# Altium schematic sheet MP_MB_2014-12-17_B.SchDoc
size A2
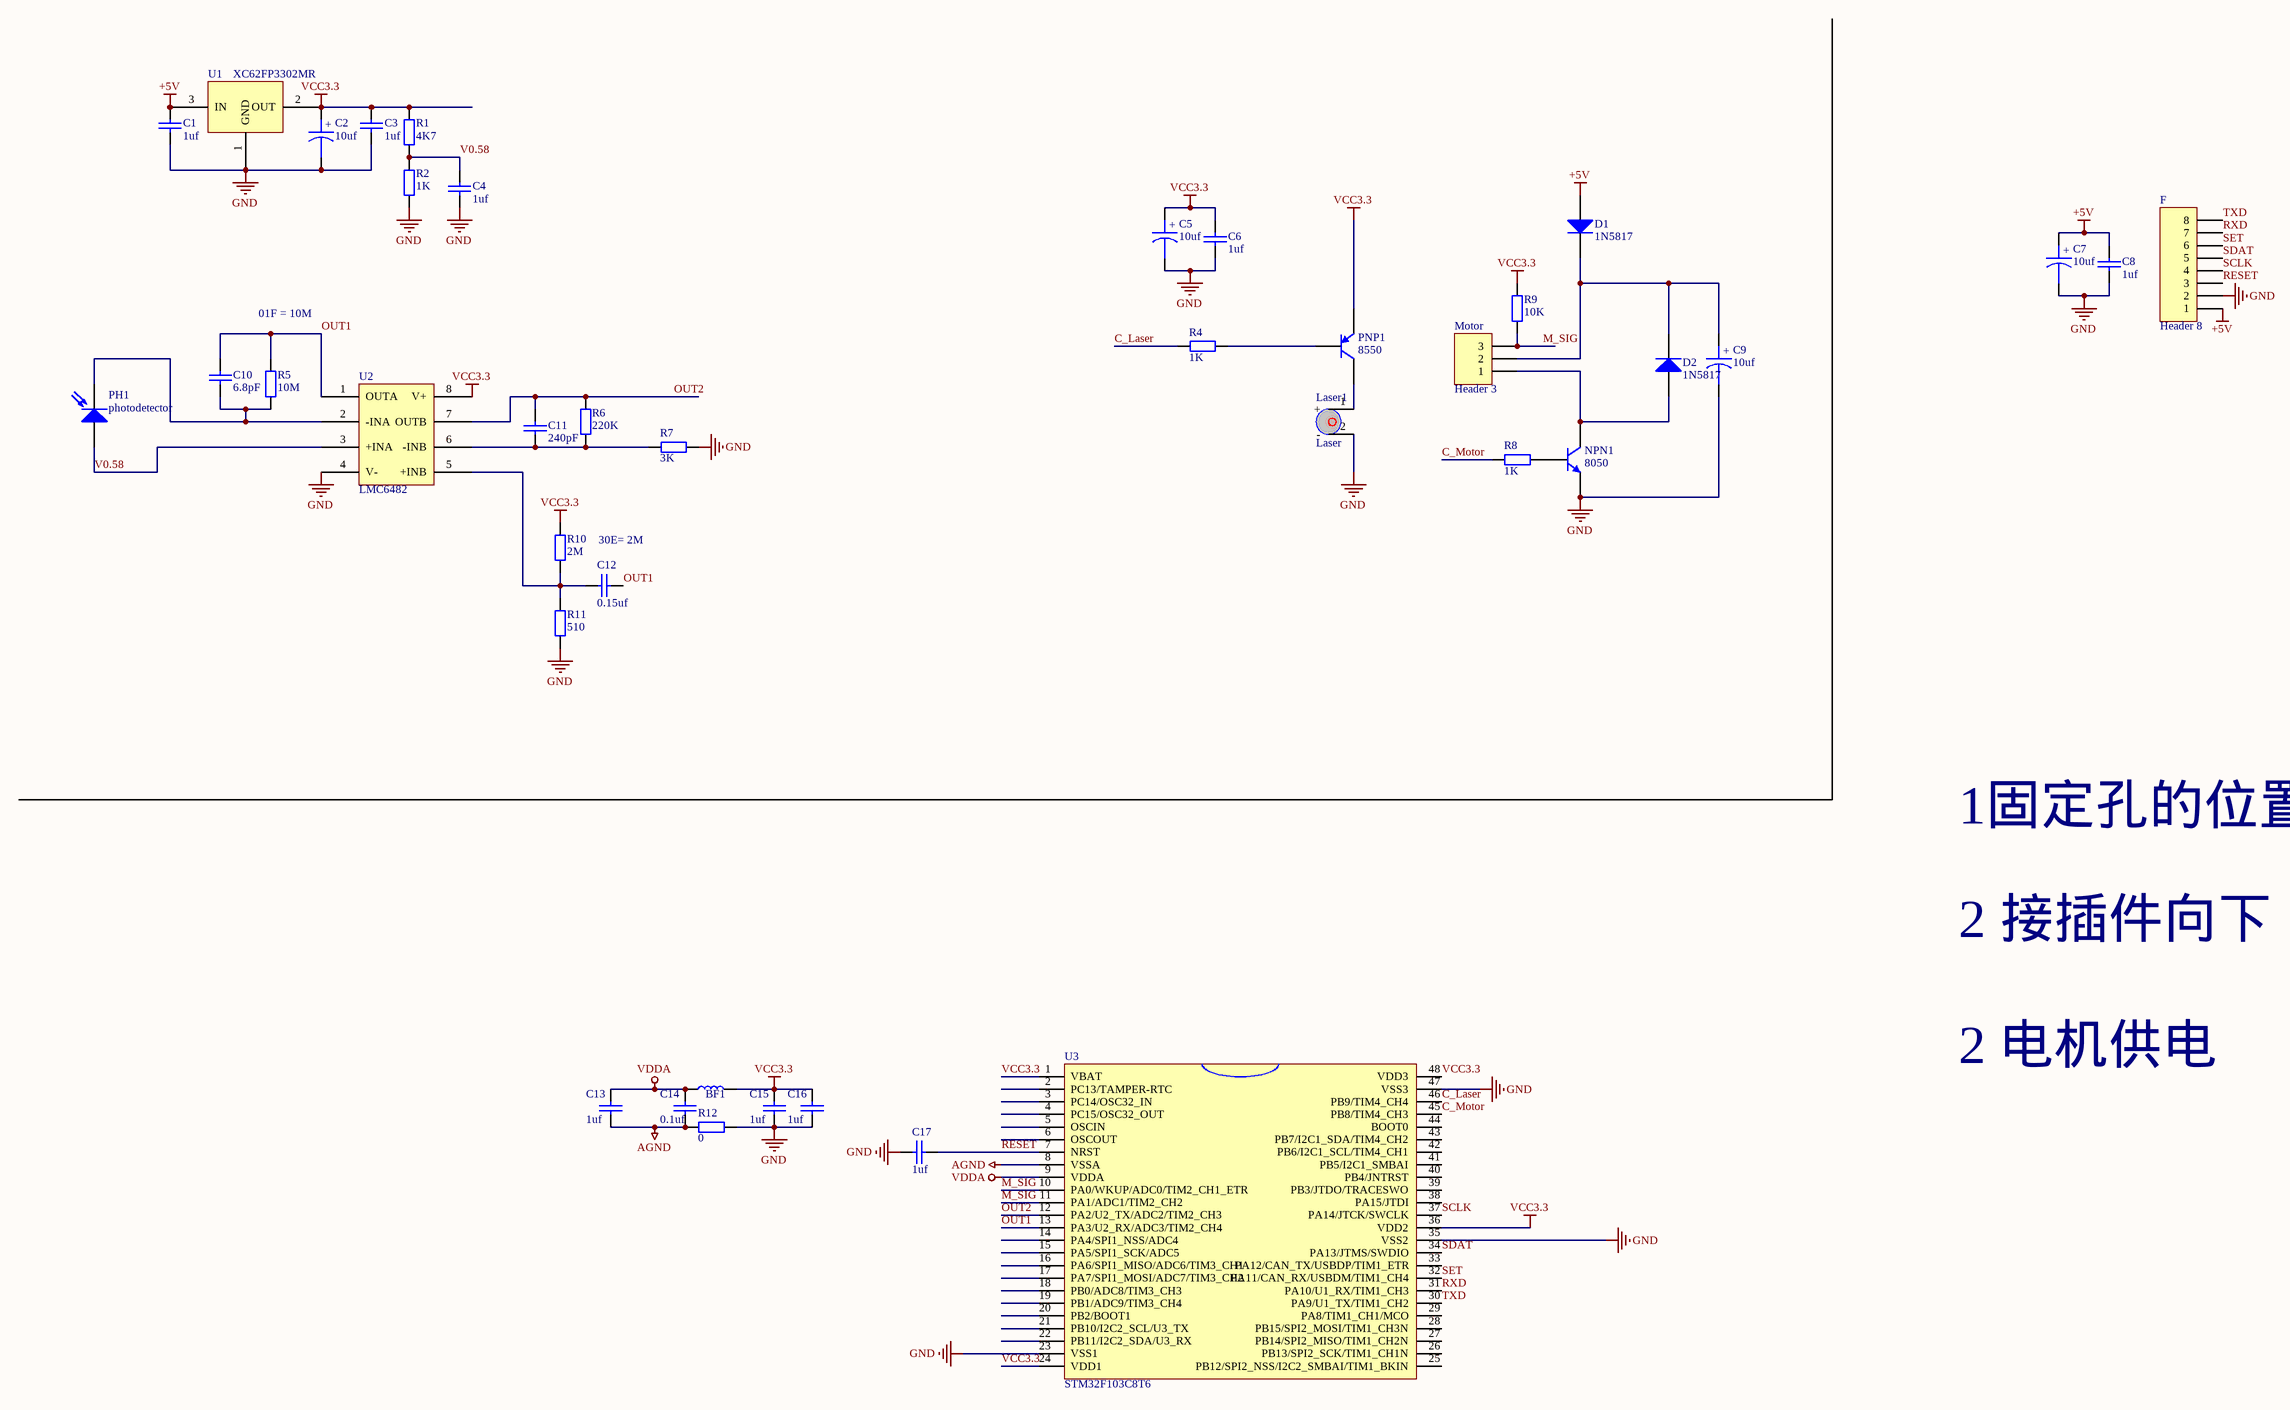
[diagram p0: MP_MB_2014-12-17_B.SchDoc]

## Parts
BF1  BF  [R0603]  (value not drawn)
C1  1uf  [C0603]
C2  10uf  [PolarC1206]
C3  1uf  [C0603]
C4  1uf  [C0603]
C5  10uf  [PolarC1206]
C6  1uf  [C0603]
C7  10uf  [PolarC1206]
C8  1uf  [C0603]
C9  10uf  [PolarC1206]
C10  6.8pF  [C0603]
C11  240pF  [C0603]
C12  0.15uf  [C0603]
C13  1uf  [C0603]
C14  0.1uf  [C0603]
C15  1uf  [C0603]
C16  1uf  [C0603]
C17  1uf  [C0603]
D1  1N5817  [Diode1206]
D2  1N5817  [Diode1206]
F  Header 8  [S-SIN-8]
Laser1  Laser  [Laser]
Motor  Header 3  [SIP3-1mm]
NPN1  8050  [SOT23-3]
PH1  photodetector  [BPW34]
PNP1  8550  [SOT23-3]
R1  4K7  [R0603]
R2  1K  [R0603]
R4  1K  [R0603]
R5  10M  [R0603]
R6  220K  [R0603]
R7  3K  [R0603]
R8  1K  [R0603]
R9  10K  [R0603]
R10  2M  [R0603]
R11  510  [R0603]
R12  0  [R0603]
U1  XC62FP3302MR  [SOT23-3]
U2  LMC6482  [SOP-8]
U3  STM32F103C8T6  [QFP-48]

## Nets
+5V: C1.1 C7.A C8.1 D1.A F.1 U1.3(IN)
AGND: C13.1 C14.1 R12.2 U3.8(VSSA)
GND: C1.2 C2.C C3.2 C4.2 C5.C C6.2 C7.C C8.2 C9.C C15.1 C16.1 C17.2 F.2 Laser1.2(-) NPN1.2(E) R2.1 R7.1 R11.1 R12.1 U1.1(GND) U2.4(V-) U3.23(VSS1) U3.35(VSS2) U3.47(VSS3)
VCC3.3: BF1.2 C2.A C3.1 C5.A C6.1 C15.2 C16.2 PNP1.2(E) R1.2 R9.2 R10.2 U1.2(OUT) U2.8(V+) U3.1(VBAT) U3.24(VDD1) U3.36(VDD2) U3.48(VDD3)
VDDA: BF1.1 C13.2 C14.2 U3.9(VDDA)
C_Laser: R4.2 U3.46(PB9/TIM4_CH4)
C_Motor: R8.2 U3.45(PB8/TIM4_CH3)
M_SIG: Motor.3 R9.1 U3.10(PA0/WKUP/ADC0/TIM2_CH1_ETR) U3.11(PA1/ADC1/TIM2_CH2)
OUT1: C10.1 C12.2 R5.2 U2.1(OUTA) U3.13(PA3/U2_RX/ADC3/TIM2_CH4)
OUT2: C11.1 R6.2 U2.7(OUTB) U3.12(PA2/U2_TX/ADC2/TIM2_CH3)
RESET: C17.1 F.3 U3.7(NRST)
RXD: F.7 U3.31(PA10/U1_RX/TIM1_CH3)
SCLK: F.4 U3.37(PA14/JTCK/SWCLK)
SDAT: F.5 U3.34(PA13/JTMS/SWDIO)
SET: F.6 U3.32(PA11/CAN_RX/USBDM/TIM1_CH4)
TXD: F.8 U3.30(PA9/U1_TX/TIM1_CH2)
V0.58: C4.1 PH1.A R1.1 R2.2 U2.3(+INA)
NetC9_A: C9.A D1.C(K) D2.C(K) Motor.2
NetC10_2: C10.2 PH1.C R5.1 U2.2(-INA)
NetC11_2: C11.2 R6.1 R7.2 U2.6(-INB)
NetC12_1: C12.1 R10.1 R11.2 U2.5(+INB)
NetD2_A: D2.A Motor.1 NPN1.3(C)
NetLaser1_1: Laser1.1(+) PNP1.3(C)
NetNPN1_1: NPN1.1(B) R8.1
NetPNP1_1: PNP1.1(B) R4.1

Not connected (* = marked no-connect by the designer): U3 2(PC13/TAMPER-RTC) 3(PC14/OSC32_IN) 4(PC15/OSC32_OUT) 5(OSCIN) 6(OSCOUT) 14(PA4/SPI1_NSS/ADC4) 15(PA5/SPI1_SCK/ADC5) 16(PA6/SPI1_MISO/ADC6/TIM3_CH1) 17(PA7/SPI1_MOSI/ADC7/TIM3_CH2) 18(PB0/ADC8/TIM3_CH3) 19(PB1/ADC9/TIM3_CH4) 20(PB2/BOOT1) 21(PB10/I2C2_SCL/U3_TX) 22(PB11/I2C2_SDA/U3_RX) 25(PB12/SPI2_NSS/I2C2_SMBAI/TIM1_BKIN) 26(PB13/SPI2_SCK/TIM1_CH1N) 27(PB14/SPI2_MISO/TIM1_CH2N) 28(PB15/SPI2_MOSI/TIM1_CH3N) 29(PA8/TIM1_CH1/MCO) 33(PA12/CAN_TX/USBDP/TIM1_ETR) 38(PA15/JTDI) 39(PB3/JTDO/TRACESWO) 40(PB4/JNTRST) 41(PB5/I2C1_SMBAI) 42(PB6/I2C1_SCL/TIM4_CH1) 43(PB7/I2C1_SDA/TIM4_CH2) 44(BOOT0)

## Notes on the sheet
- 01F = 10M
- 30E= 2M
- 1固定孔的位置
- 2 接插件向下，向里
- 2 电机供电
- (in symbol PolarCap) +

## Library data of the parts
BF1 = BF: 磁珠
C1 C3 C4 C6 C8 C10-C17 = C: Attributes: 10V 20%  Non polar capacitor
C2 C5 C7 C9 = PolarCap: Attributes: A 10V
D1 D2 = Diode: Attributes: *
F = Header 8: Header, 8-Pin; LatestRevisionDate: 17-Jul-2002; LatestRevisionNote: Re-released for DXP Platform.; Publisher: Altium Limited
Motor = Header 3: Header, 3-Pin; LatestRevisionDate: 17-Jul-2002; LatestRevisionNote: Re-released for DXP Platform.; Publisher: Altium Limited
NPN1 = NPN: Puchase: C2146; Attributes: *
PH1 = PH: Attributes: *
PNP1 = PNP: Attributes: *
R1 R2 R4-R12 = R: Attributes: 1% Stacked resistance
U2 = AD8629: Attributes: *